# EasyEDA Pro project _Music IN + Balance NEXT GEN_2026-02-06.epro

# Schematic Schematic1
Board Name: Board1; Create Date: 2025-11-03; Page Name: P1; Project Name: Music IN + Balance NEXT GEN; Schematic Name: Schematic1; Update Date: 2025-11-07; Company: EasyEDA.com; Page Size: A4; Version: V1.0
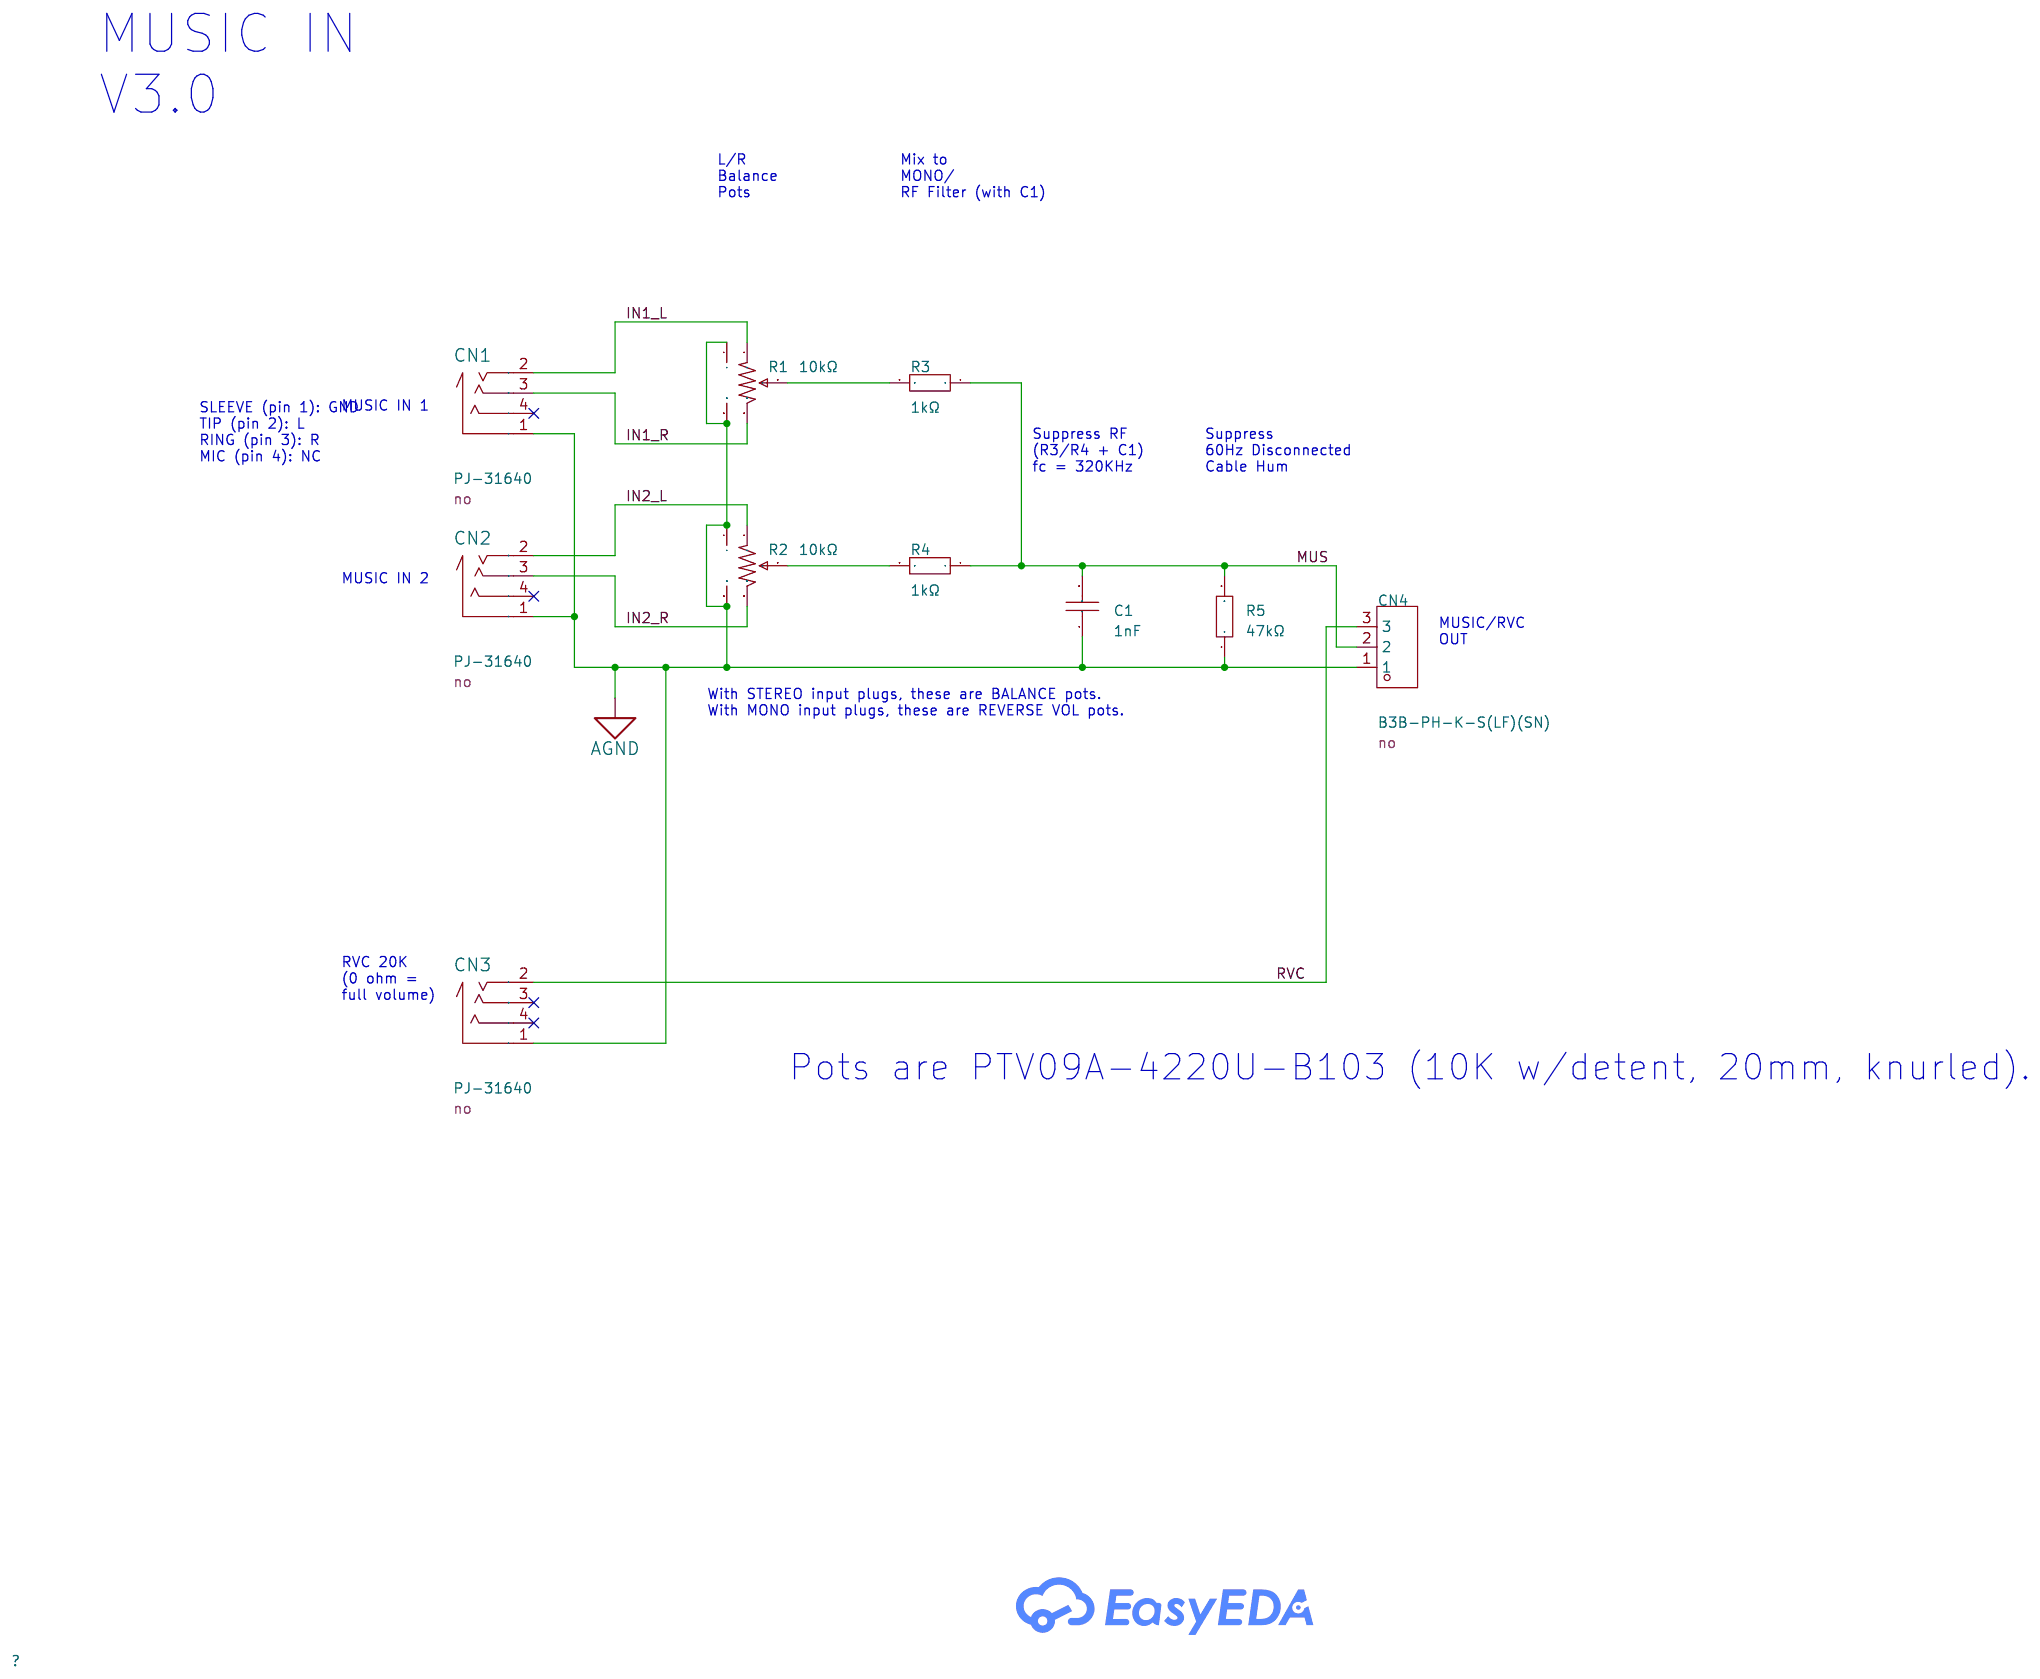
[diagram p0: schematic sheet]

## Parts
C1  1nF  [C0402]
CN1  PJ-31640  [AUDIO-TH_XKB_PJ-31640]  (no BOM)
CN2  PJ-31640  [AUDIO-TH_XKB_PJ-31640]  (no BOM)
CN3  PJ-31640  [AUDIO-TH_XKB_PJ-31640]  (no BOM)
CN4  B3B-PH-K-S(LF)(SN)  [CONN-TH_B3B-PH-K-S]  (no BOM)
R1  10kΩ  [SW-TH_PTV09A-4015F-B502]
R2  10kΩ  [SW-TH_PTV09A-4015F-B502]
R3  1kΩ  [R0402]
R4  1kΩ  [R0402]
R5  47kΩ  [R0402]

## Library data of the parts
C1 = 0402B102K500NT: Capacitance:1nF Tolerance:±10% Tolerance:±10% Voltage Rating:50V Temperature Coefficient:X7R; LCSC Part Name: 1nF ±10% 50V; Supplier Part: C1523; Manufacturer: FH(风华); Supplier Footprint: 0402; JLCPCB Part Class: Basic Part; Datasheet: https://item.szlcsc.com/datasheet/0402B102K500NT/1875.html; Supplier: LCSC; Tolerance: ±10%; Voltage Rating: 50V; Temperature Coefficient: X7R
CN1-CN3 = PJ-31640: Connector Type:3.5mm耳机座 Current Rating (Max):500mA Voltage Rating (Max):30V Operating Temperature Range:-20℃~+70℃ Operating Temperature Range:-20℃~+70℃ Soldering Temperature(Max):235℃; LCSC Part Name: 3.5mm耳机座; Supplier Part: C2879830; Manufacturer: XKB Connectivity(中国星坤); Supplier Footprint: 插件; JLCPCB Part Class: Extended Part; Datasheet: https://atta.szlcsc.com/upload/public/pdf/source/20210902/E3772AA4B361BDF8376D7D18611F7BA0.pdf; Supplier: LCSC; Connector Type: 3.5mm耳机座; Current Rating (Max): 500mA; Voltage Rating (Max): 30V; Operating Temperature Range: -20℃~+70℃; Soldering Temperature(Max): 235℃
CN4 = B3B-PH-K-S(LF)(SN): Pins Structure:1x3P Pitch:2mm Mounting Style:Straight Reference Series:PH Number of Pins:3P Number of Rows:1 Number of PINs Per Row:3 Row Spacing:- Current Rating (Max):2A Contact Material:Brass Contact Plating:Tin Operating Temperature Range:-25℃~+85℃ Op; LCSC Part Name: 1x3P 间距:2mm 直插 系列:PH; Supplier Part: C131339; Manufacturer: JST; Supplier Footprint: 插件,P=2mm; JLCPCB Part Class: Extended Part; Datasheet: https://atta.szlcsc.com/upload/public/pdf/source/20171026/C131342_15089839687311058815.pdf; Supplier: LCSC; Pins Structure: 1x3P; Pitch: 2mm; Mounting Style: Straight; Reference Series: PH; Number of Pins: 3P; Number of Rows: 1; Number of PINs Per Row: 3; Current Rating (Max): 2A; Contact Material: Brass; Contact Plating: Tin; Operating Temperature Range: -25℃~+85℃; Rated Voltage (Max): 100V; Plastic Material: PA66; Flame Retardant Rating: UL94V-0; Supplementary Features: 打K脚; Colour: White; Z-Height of the Board: 6mm; X-Length of Bottom Edge on Board (Spacing Line): 7.9mm; Y-Width of Bottom Edge on Board: 4.5mm
R1 R2 = PTV09A-4220U-B103: Resistance:10kΩ Tolerance:±20% Tolerance:±20% Voltage Rating:20V Power(Watts):50mW Number of Turns:; LCSC Part Name: ±20%; Supplier Part: C7328484; Manufacturer: BOURNS; Supplier Footprint: 插件; JLCPCB Part Class: Extended Part; Datasheet: https://item.szlcsc.com/datasheet/PTV09A-4220U-B103/8299183.html; Supplier: LCSC; Tolerance: ±20%; Voltage Rating: 20V; Power(Watts): 50mW
R3 R4 = 0402WGF1001TCE: Type:Thick Film Resistors Resistance: Tolerance:±1% Tolerance:±1% Power(Watts): Temperature Coefficient:±100ppm/℃ Temperature Coefficient:±100ppm/℃ Overload Voltage (Max): Operating Temperature Range:-55℃~+155℃ Operating Temperature Range:-55℃~+155℃; LCSC Part Name: 1kΩ ±1% 62.5mW; Supplier Part: C11702; Manufacturer: UNI-ROYAL(厚声); Supplier Footprint: 0402; JLCPCB Part Class: Basic Part; Datasheet: https://atta.szlcsc.com/upload/public/pdf/source/20200306/C422600_1E6D84923E4A46A82E41ADD87F860B5C.pdf; Supplier: LCSC; Type: Thick Film Resistors; Tolerance: ±1%; Temperature Coefficient: ±100ppm/℃; Operating Temperature Range: -55℃~+155℃; Check: true
R5 = 0402WGF4702TCE: Type:Thick Film Resistor Resistance:47kΩ Tolerance:±1% Tolerance:±1% Power(Watts):62.5mW Voltage-Supply(Max):50V Temperature Coefficient:±100ppm/℃ Temperature Coefficient:±100ppm/℃ Operating Temperature:-55℃~+155℃ Operating Temperature:-55℃~+155℃; LCSC Part Name: 47kΩ ±1% 62.5mW 厚膜电阻; Supplier Part: C25792; Manufacturer: UNI-ROYAL(厚声); Supplier Footprint: 0402; JLCPCB Part Class: Basic Part; Datasheet: https://item.szlcsc.com/datasheet/0402WGF4702TCE/26535.html; Supplier: LCSC; Type: Thick Film Resistor; Tolerance: ±1%; Power(Watts): 62.5mW; Voltage-Supply(Max): 50V; Temperature Coefficient: ±100ppm/℃; Operating Temperature: -55℃~+155℃

## Nets
AGND: C1.1 CN1.1 CN2.1 CN3.1 CN4.1 R1.4 R1.5 R2.4 R2.5 R5.1
IN1_L: CN1.2 R1.1
IN1_R: CN1.3 R1.3
IN2_L: CN2.2 R2.1
IN2_R: CN2.3 R2.3
MUS: C1.2 CN4.2 R3.1 R4.1 R5.2
RVC: CN3.2 CN4.3
$1N997: R2.2 R4.2
$1N1002: R1.2 R3.2

Not connected (* = marked no-connect by the designer): CN1 4*; CN2 4*; CN3 3* 4*

## Notes on the sheet
- MUSIC IN
  V3.0
- L/R
  Balance
  Pots
- Mix to
  MONO/
  RF Filter (with C1)
- MUSIC IN 1
- SLEEVE (pin 1): GND
  TIP (pin 2): L
  RING (pin 3): R
  MIC (pin 4): NC
- Suppress RF
  (R3/R4 + C1)
  fc = 320KHz
- Suppress
  60Hz Disconnected
  Cable Hum
- MUSIC IN 2
- MUSIC/RVC
  OUT
- With STEREO input plugs, these are BALANCE pots.
  With MONO input plugs, these are REVERSE VOL pots.
- RVC 20K
  (0 ohm =
  full volume)
- Pots are PTV09A-4220U-B103 (10K w/detent, 20mm, knurled).

# Board PCB1
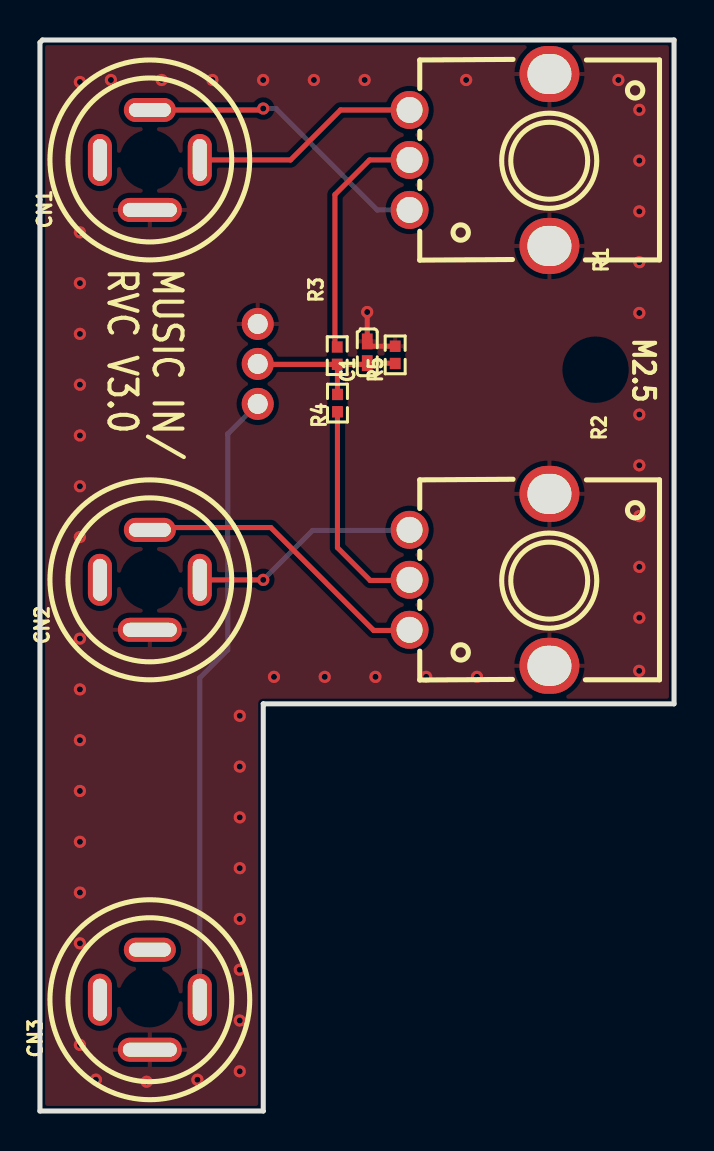
[diagram p1: board, top side]
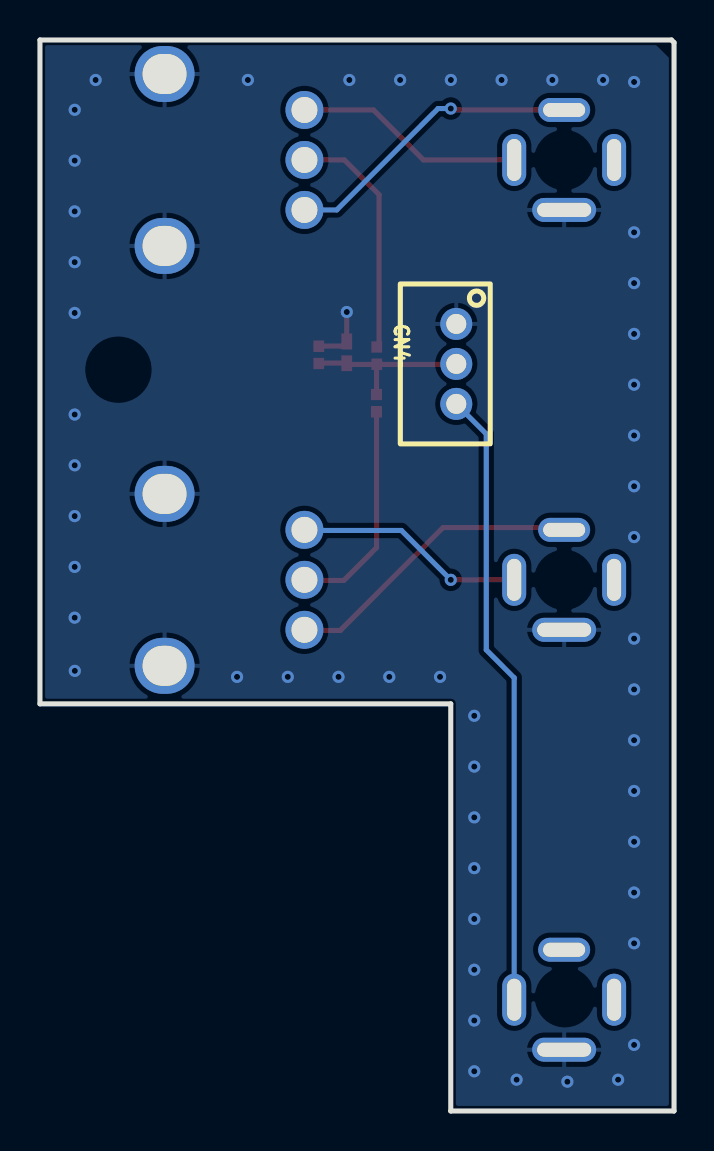
[diagram p2: board, bottom side, seen from below]

Outline 31.74 x 53.57 mm; copper layers: Top Layer, Bottom Layer. Coordinates in mm from the lower left corner of the outline.
Outline path: 0,53.44 0.13,53.57 31.74,53.57 31.74,20.36 11.18,20.36 11.18,0 0,0 0,53.44
Stack: Top Layer 0.035mm / Dielectric1 1.51mm FR4 er 4.5 / Bottom Layer 0.035mm

## Design rules (mm)
template: JLCPCB Capability(Two Layers Board)
spacing copperThickness1oz (default): track to track 0.102, other pairs 0.152 to 0.3
spacing copperThickness2oz: track to track 0.203, other pairs 0.152 to 0.3
track width copperThickness1oz (default): min 0.127, default 0.254, max 2.54
track width copperThickness2oz: min 0.203, default 0.254, max 2.54
differential pair differentialPair (default): width min 0.127, default 0.254, max 2.54; gap min 0.152, default 0.152
via viaSize (default): diameter min 0.5, default 0.61, max 10; hole min 0.3, default 0.305, max 6.3

## Placement (name value [footprint] x y rotation side)
C1  1nF  [C0402]  16.38 37.95 270 top
CN1  PJ-31640  [AUDIO-TH_XKB_PJ-31640]  5.5 47.57 0 top
CN2  PJ-31640  [AUDIO-TH_XKB_PJ-31640]  5.5 26.57 0 top
CN3  PJ-31640  [AUDIO-TH_XKB_PJ-31640]  5.5 5.57 0 top
CN4  B3B-PH-K-S(LF)(SN)  [CONN-TH_B3B-PH-K-S]  10.9 37.37 90 bottom
R1  10kΩ  [SW-TH_PTV09A-4015F-B502]  22 47.57 270 top
R2  10kΩ  [SW-TH_PTV09A-4015F-B502]  22 26.57 270 top
R3  1kΩ  [R0402]  14.88 37.78 90 top
R4  1kΩ  [R0402]  14.89 35.41 270 top
R5  47kΩ  [R0402]  17.78 37.82 270 top

## Footprints (pads in the part's own frame, mm; a bottom-side part is the same pattern mirrored in y, then rotated)
AUDIO-TH_XKB_PJ-31640
  oval 3.2x1.2 hole 2.7x0.7: 1(0,-2.5)
  oval 1.2x2.6 hole 0.7x2.1: 2(2.5,0) 4(-2.5,0)
  oval 2.6x1.2 hole 2.1x0.7: 3(0,2.5)
C0402
  rect 0.79x0.54 smd: 1(-0.545,0) 2(0.545,0)
CONN-TH_B3B-PH-K-S
  round 1.6 hole 1: 1(2,0) 2(0,0) 3(-2,0)
R0402
  rect 0.566x0.54 smd: 1(-0.433,0) 2(0.433,0)
SW-TH_PTV09A-4015F-B502
  round 1.9 hole 1.3: 1(-2.5,-3.5) 2(0,-3.5) 3(2.5,-3.5)
  oval 2.8x3 hole 2x2.2: 4(-4.3,3.5) 5(4.3,3.5)

## Nets
As in the schematic.

Pads without a net: CN1 4; CN2 4; CN3 3 4

## Via types
v1: diameter 0.61, hole 0.305, Top Layer to Bottom Layer, 54 vias

## Routing (per net, layer and track width the routed paths; a pad name or vN(x,y) marks a point on that pad's centre or on a via; arc(x,y) is an arc through that point)
AGND: length 3
  Top Layer w0.254: R5.1 16.62,38.25 C1.1 16.38,39.96 v1(16.38,39.96)
  vias: v1(2,51.47) v1(2,43.95) v1(2,41.41) v1(2,38.87) v1(2,36.33) v1(2,33.79) v1(2,31.25) v1(2,28.71) v1(2,23.63) v1(2,21.09) v1(2,18.55) v1(2,16.01) v1(2,13.47) v1(2,10.93) v1(2,8.39) v1(2,3.31) v1(2.8,1.57) v1(3.55,51.57) v1(5.34,1.47) v1(6.09,51.57) v1(7.88,1.57) v1(8.63,51.57) v1(10,19.77) v1(10,17.23) v1(10,14.69) v1(10,12.15) v1(10,9.61) v1(10,7.07) v1(10,4.53) v1(10,1.99) v1(11.17,51.57) v1(11.71,21.71) v1(13.71,51.57) v1(14.25,21.71) v1(16.25,51.57) v1(16.79,21.71) v1(19.33,21.71) v1(21.33,51.57) v1(21.87,21.71) v1(28.95,51.57) v1(30,50.07) v1(30,47.53) v1(30,44.99) v1(30,42.45) v1(30,39.91) v1(30,34.83) v1(30,32.29) v1(30,29.75) v1(30,27.21) v1(30,24.67) v1(29.99,22.01)
IN1_L: length 11.5
  Top Layer w0.254: CN1.2 12.54,47.57 15.04,50.07 18.51,50.07
IN1_R: length 15.1
  Top Layer w0.254: v1(11.18,50.14) 11.1,50.07 CN1.3
  Bottom Layer w0.254: 18.51,45.07 16.88,45.07 11.81,50.14 v1(11.18,50.14)
IN2_L: length 11.5
  Top Layer w0.254: CN2.2 v1(11.18,26.57)
  Bottom Layer w0.254: v1(11.18,26.57) 13.64,29.03 18.5,29.03
IN2_R: length 15
  Top Layer w0.254: 5.62,29.18 11.56,29.18 16.7,24.03 18.5,24.03
MUS: length 8.4
  Top Layer w0.254: R3.1 16.33,37.34 C1.2 17.77,37.4 17.78,37.39 ; R3.1 14.89,37.33 R4.1 ; R3.1 10.92,37.34 CN4.2
RVC: length 31
  Bottom Layer w0.254: CN4.3 9.4,33.87 9.4,23.07 8,21.67 CN3.2
$1N997: length 11.1
  Top Layer w0.254: R4.2 14.89,28.17 16.53,26.53 18.5,26.53
$1N1002: length 12.1
  Top Layer w0.254: 14.88,38.21 14.76,38.33 14.76,45.83 16.5,47.57 18.51,47.57

## Copper pours and planes (outline as drawn; the poured copper is in the pictures)
AGND on Top Layer: 0.01,53.56 31.72,53.56 31.72,0.03 0,0
AGND on Bottom Layer: 1.13,53.56 31.72,53.56 31.72,0.05 -0.01,0.05 -0.01,52.41

## Text on the board
Top Silkscreen Layer: M2.5 | MUSIC IN/ / RVC V3.0
